# Altium schematic sheet Temp_V_DC_Measurement.SchDoc
size A4; CompanyName: Technische Hochschule Nürnberg Georg Simon Ohm; Organization: UltraZohm; Address1: Kesslerplatz 12; Address2: 90489 Nürnberg; Address3: GERMANY; SheetNumber: 5; SheetTotal: 7; Website: www.ultrazohm.com
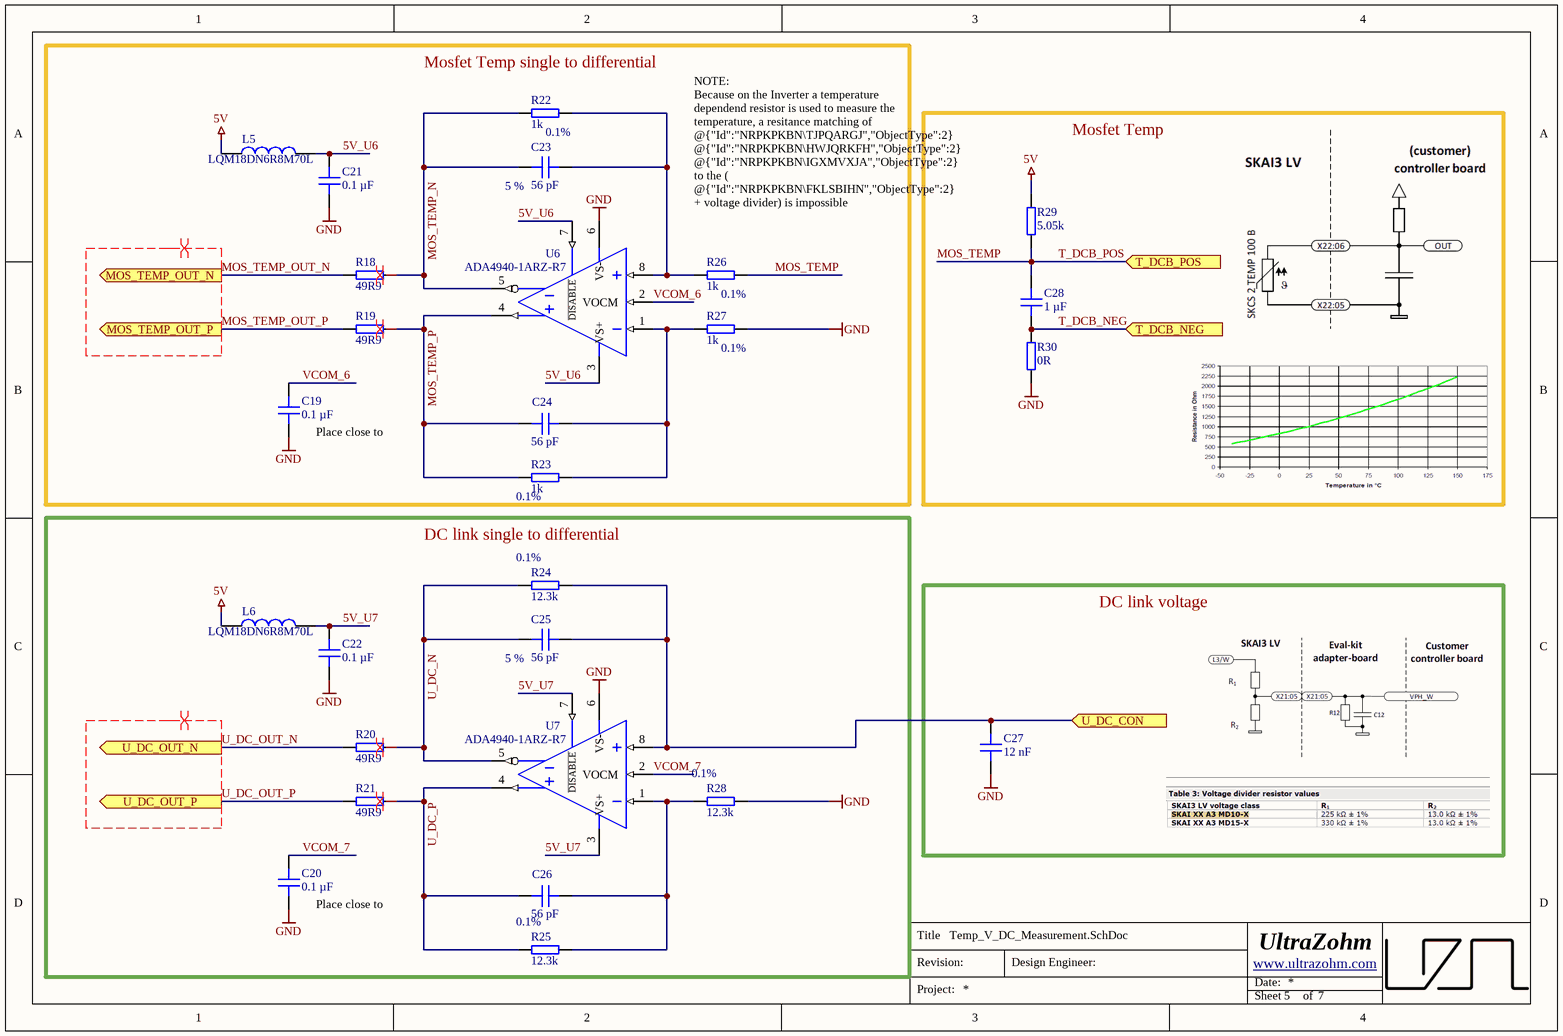
[diagram p0: Temp_V_DC_Measurement.SchDoc]

## Parts
C19  0.1 µF  [C_0603]
C20  0.1 µF  [C_0603]
C21  0.1 µF  [C_0603]
C22  0.1 µF  [C_0603]
C23  56 pF  Tolerance: 5 %  [C_0603]
C24  56 pF  [C_0603]
C25  56 pF  Tolerance: 5 %  [C_0603]
C26  56 pF  [C_0603]
C27  12 nF  [C_0603]
C28  1 µF  [C_1206]
L5  LQM18DN6R8M70L  [INDC1608X95N]
L6  LQM18DN6R8M70L  [INDC1608X95N]
R18  49R9  [RES 0603_1608]
R19  49R9  [RES 0603_1608]
R20  49R9  [RES 0603_1608]
R21  49R9  [RES 0603_1608]
R22  1k  Tolerance: 0.1%  [RES 0603_1608]
R23  1k  Tolerance: 0.1%  [RES 0603_1608]
R24  12.3k  Tolerance: 0.1%  [RES 0603_1608]
R25  12.3k  Tolerance: 0.1%  [RES 0603_1608]
R26  1k  Tolerance: 0.1%  [RES 0603_1608]
R27  1k  Tolerance: 0.1%  [RES 0603_1608]
R28  12.3k  Tolerance: 0.1%  [RES 0603_1608]
R29  5.05k  [RES 0603_1608]
R30  0R  [RES 0603_1608]
U6  ADA4940-1ARZ-R7  [SOT127P600X175-8N]
U7  ADA4940-1ARZ-R7  [SOT127P600X175-8N]

## Blocks framed on the sheet
Mosfet Temp single to differential: C19 C21 C23 C24 L5 R18 R19 R22 R23 R26 R27 U6
Mosfet Temp: C28 R29 R30
DC link single to differential: C20 C22 C25 C26 L6 R20 R21 R24 R25 R28 U7
DC link voltage: C27

## Ports
MOS_TEMP_OUT_N (out), MOS_TEMP_OUT_P (out), T_DCB_NEG (in), T_DCB_POS (in), U_DC_CON (in), U_DC_OUT_N (out), U_DC_OUT_P (out)

## Nets
5V: L5.1 L6.1 R29.2
GND: C19.1 C20.1 C21.1 C22.1 C27.1 R27.1 R28.2 R30.1 U6.6(VS-) U7.6(VS-)
5V_U6: C21.2 L5.2 U6.3(VS+) U6.7(~{DISABLE})
5V_U7: C22.2 L6.2 U7.3(VS+) U7.7(~{DISABLE})
MOS_TEMP: C28.2 R26.1 R29.1 ; port T_DCB_POS  [also labelled T_DCB_POS]
MOS_TEMP_N: C23.1 R18.2 R22.2 U6.5(VOUT-)
MOS_TEMP_OUT_N: R18.1 ; port MOS_TEMP_OUT_N
MOS_TEMP_OUT_P: R19.1 ; port MOS_TEMP_OUT_P
MOS_TEMP_P: C24.1 R19.2 R23.2 U6.4(VOUT+)
T_DCB_NEG: C28.1 R30.2 ; port T_DCB_NEG
U_DC_CON: C25.2 C27.2 R24.2 U7.8(VIN+) ; port U_DC_CON
U_DC_N: C25.1 R20.2 R24.1 U7.5(VOUT-)
U_DC_OUT_N: R20.1 ; port U_DC_OUT_N
U_DC_OUT_P: R21.1 ; port U_DC_OUT_P
U_DC_P: C26.1 R21.2 R25.1 U7.4(VOUT+)
VCOM_6: C19.2 U6.2(VOCM)
VCOM_7: C20.2 U7.2(VOCM)
NetC23_2: C23.2 R22.1 R26.2 U6.8(VIN+)
NetC24_2: C24.2 R23.1 R27.2 U6.1(VIN-)
NetC26_2: C26.2 R25.2 R28.1 U7.1(VIN-)

## Layout directives
differential pair: MOS_TEMP_N, MOS_TEMP_OUT_N, MOS_TEMP_OUT_P, MOS_TEMP_P, U_DC_N, U_DC_OUT_N, U_DC_OUT_P, U_DC_P

## Notes on the sheet
- (near R26) NOTE:
  Because on the Inverter a temperature dependend resistor is used to measure the temperature, a resitance matching of @{"Id":"NRPKPKBN\TJPQARGJ","ObjectType":2} @{"Id":"NRPKPKBN\HWJQRKFH","ObjectType":2} @{"Id":"NRPKPKBN\IGXMVXJA","ObjectType":2} to the ( @{"Id":"NRPKPKBN\FKLSBIHN","ObjectType":2} + voltage divider) is impossible
- (near C19) Place close to @{"Id":"NRPKPKBN\YIMAHXXS","ObjectType":2}
- (near C20) Place close to @{"Id":"NRPKPKBN\RQVLHYIW","ObjectType":2}
- Title
- Revision:
- Design Engineer:
- Date:
- Project:
- Sheet
- of

## Library data of the parts
C19-C22 = C0603X104K5RAC7411: Capacitor 0603, 50 VDC, 0.1 µF, X7R; Manufacturer: KEMET; Tolerance: 10 %; Voltage Rating: 50 VDC; Created from: MGremer; Manufacturer Part Number: C0603X104K5RAC7411; PartID: 3; Created On: 20.12.2020 13:54:13; ComponentLink1Description: Datasheet; ComponentLink1URL: https://www.mouser.de/datasheet/2/212/1/KEM_C1013_X7R_FT_CAP_SMD-1103280.pdf; Component Type: Capacitor 0603; Device Package: 0603; Last Updated: 04.03.2021 09:24:28; Mounting Type: SMD; Operating Temperature: -55 - 125°C; Series: SMD Comm X7R Flex; Supplier 1: Mouser; Supplier Part Number 1: 80-C0603X104K5R7411; Supplier 2: LCSC; Supplier Part Number 2: C14663; Type: Capacitor; Value: 0.1 µF; Live Cycle Status: 1; LCSC Part Number: C14663; Stock number: Labor SMD Container
C23 C25 = CL10C560JB8NNNC: Capacitor 0603, 50 VDC, 56 pF, C0G; Manufacturer: Samsung Electro-Mechanics; Voltage Rating: 50 VDC; Created from: DHufnagel; Manufacturer Part Number: CL10C560JB8NNNC; PartID: 92; Created On: 20.12.2020 13:54:13; ComponentLink1Description: Datasheet; ComponentLink1URL: https://www.mouser.de/datasheet/2/585/MLCC-1837944.pdf; Component Type: Capacitor 0603; Device Package: 0603; Last Updated: 20.12.2020 16:24:16; Mounting Type: SMD; Operating Temperature: -55 - 125°C; Series: CL; Supplier 1: Mouser; Supplier Part Number 1: 187-CL10C560JB8NNNC; Type: Capacitor; Value: 56 pF; Live Cycle Status: 1; Stock number: not stored; Supplier 2: LCSC; Supplier Part Number 2: C39148; LCSC Part Number: C39148
C24 C26 = CL10C560JB8NNNC: Capacitor 0603, 50 VDC, 56 pF, C0G; Manufacturer: Samsung Electro-Mechanics; Tolerance: 5 %; Voltage Rating: 50 VDC; Created from: DHufnagel; Manufacturer Part Number: CL10C560JB8NNNC; PartID: 92; Created On: 20.12.2020 13:54:13; ComponentLink1Description: Datasheet; ComponentLink1URL: https://www.mouser.de/datasheet/2/585/MLCC-1837944.pdf; Component Type: Capacitor 0603; Device Package: 0603; Last Updated: 20.12.2020 16:24:16; Mounting Type: SMD; Operating Temperature: -55 - 125°C; Series: CL; Supplier 1: Mouser; Supplier Part Number 1: 187-CL10C560JB8NNNC; Supplier 2: LCSC; Supplier Part Number 2: C39148; Type: Capacitor; Value: 56 pF; Live Cycle Status: 1; LCSC Part Number: C39148; Stock number: not stored
C27 = CC0603KRX7R7BB123: Capacitor 0603, 16 VDC, 12 nF, X7R; Manufacturer: Yageo; Tolerance: 10 %; Voltage Rating: 16 VDC; Created from: MGremer; Manufacturer Part Number: CC0603KRX7R7BB123; PartID: 47; Created On: 20.12.2020 13:54:13; ComponentLink1Description: Datasheet; ComponentLink1URL: https://www.mouser.de/datasheet/2/447/UPY-GPHC_X7R_6.3V-to-50V_18-1154002.pdf; Component Type: Capacitor 0603; Device Package: 0603; Last Updated: 16.04.2024 13:21:40; Mounting Type: SMD; Operating Temperature: -55 - 125°C; Series: CC; Supplier 1: Mouser; Supplier Part Number 1: 603-CC603KRX7R7BB123; Type: Capacitor; Value: 12 nF; Live Cycle Status: 1; LCSC Part Number: C519427; Stock number: not stored
C28 = C1206X105K5RECAUTO: Capacitor 1206, 50 VDC, 1 µF, X7R; Manufacturer: KEMET; Tolerance: 10 %; Voltage Rating: 50 VDC; Created from: MGremer; Manufacturer Part Number: C1206X105K5RECAUTO; PartID: 39; Created On: 20.12.2020 13:54:13; ComponentLink1Description: Datasheet; ComponentLink1URL: https://www.mouser.de/datasheet/2/212/1/KEM_C1090_X7R_ESD-1103328.pdf; Component Type: Capacitor 1206; Device Package: 1206; Last Updated: 24.10.2023 13:41:37; Mounting Type: SMD; Operating Temperature: -55 - 125°C; Series: ESD SMD Auto X7R; Supplier 1: Mouser; Supplier Part Number 1: 80-C1206X105K5REAUTO; Type: Capacitor; Value: 1 µF; Live Cycle Status: 1; LCSC Part Number: C107185; Stock number: Labor SMD Container
L5 L6 = LQM18DN6R8M70L: 6.8µH, 120mA, 0603, 740mOhm, 20%; Manufacturer: Murata; MF: EPCOS / TDK; Value: 6.8uH; DCR: 320m; Rated Current: 0.85 A; Type: fixed inductor; Created from: DHufnagel; MPN: B82464G4154M; Supplier 1: Mouser; Supplier Part Number 1: 81-LQM18DN6R8M70L; Manufacturer Part Number: LQM18DN6R8M70L; PartID: 10; Created On: 19.07.2022 15:47:17; ComponentLink1Description: Datasheet; ComponentLink1URL: https://www.mouser.de/datasheet/2/281/1/JELF243B_0086-2298241.pdf; Component Type: SMD fixed inductor; Device Package: SMD; Last Updated: 15.06.2023 16:03:16; Mounting Type: SMD; Operating Temperature: -40 - 125°C; Series: LQM18DN_70; Supplier 2: Digi-Key; Supplier Part Number 2: 490-LQM18DN6R8M70LCT-ND; DC current: 120mA; Live Cycle Status: 1; Stock number: not stored; LCSC Part Number: C1881372
R18-R21 = RK73H1JTTD49R9F: SMD resistor 1%; Manufacturer: KOA Speer; Created from: DHufnagel; Manufacturer Part Number: RK73H1JTTD49R9F; PartID: 214; Created On: 14.12.2020 16:17:14; ComponentLink1Description: Datasheet; ComponentLink1URL: https://www.mouser.de/datasheet/2/219/RK73H-1825326.pdf; Component Type: SMD resistor; Device Package: 0603; Last Updated: 27.05.2022 13:46:35; Mounting Type: SMD; Supplier 1: Mouser; Supplier Part Number 1: 660-RK73H1JTTD49R9F; Supplier 2: LCSC; Supplier Part Number 2: C160046; Type: Resistor; Tolerance: 1%; Value: 49R9; Live Cycle Status: 1; Stock number: not stored; LCSC Part Number: C160046
R22 R23 R26 R27 = PCF-W0603LF-03-1001-B-P-LT: SMD resistor 0.1%; Manufacturer: IRC / TT Electronics; Created from: MGremer; Manufacturer Part Number: PCF-W0603LF-03-1001-B-P-LT; PartID: 163; Created On: 14.12.2020 16:17:14; ComponentLink1Description: Datasheet; ComponentLink1URL: https://www.mouser.de/datasheet/2/414/PCF-1528243.pdf; Component Type: SMD resistor; Device Package: 0603; Last Updated: 21.02.2024 15:45:55; Mounting Type: SMD; Supplier 1: Mouser; Supplier Part Number 1: 66-PCFW0603LF031001B; Type: Resistor; Value: 1k; Live Cycle Status: 1; Stock number: not stored; LCSC Part Number: C110776
R24 R25 R28 = RT0603BRD0712K3L: SMD resistor E24 series 12 kOhms 100mW 0603 1%; Manufacturer: YAGEO; Created from: DHufnagel; Manufacturer Part Number: RT0603BRD0712K3L; PartID: 333; Created On: 10.02.2023 10:27:45; ComponentLink1Description: Datasheet; ComponentLink1URL: https://www.mouser.de/datasheet/2/447/PYu_RT_1_to_0_01_RoHS_L_12-3003070.pdf; Component Type: SMD resistor; Device Package: 0603; Last Updated: 03.05.2024 10:37:15; Mounting Type: SMD; Supplier 1: Mouser; Supplier Part Number 1: 603-RT0603BRD0712K3L; Type: Resistor; Value: 12.3k; Live Cycle Status: 1; Stock number: not stored; LCSC Part Number: C861101
R29 = TNPW06035K05BEEA: SMD resistor 0.1%; Manufacturer: Vishay; Created from: DHufnagel; Manufacturer Part Number: TNPW06035K05BEEA; PartID: 338; Created On: 01.12.2022 09:50:56; ComponentLink1Description: Datasheet; ComponentLink1URL: https://www.vishay.com/doc?28758; Component Type: SMD resistor; Device Package: 0603; Last Updated: 03.05.2024 10:51:07; Mounting Type: SMD; Supplier 1: Mouser; Supplier Part Number 1: 71-TNPW06035K05BEEA; Type: Resistor; Tolerance: 0.1%; Value: 5.05k; Live Cycle Status: 1; Stock number: not stored; LCSC Part Number: C1693738
R30 = RC0603JR-070RL: SMD resistor E24 series; Manufacturer: YAGEO; Tolerance: 5%; Created from: MGremer; Manufacturer Part Number: RC0603JR-070RL; PartID: 1; Created On: 14.12.2020 16:17:14; ComponentLink1Description: Datasheet; ComponentLink1URL: https://www.mouser.de/datasheet/2/447/PYu-RC_Group_51_RoHS_L_10-1664068.pdf; Component Type: SMD resistor; Device Package: 0603; Last Updated: 04.03.2021 09:09:42; Mounting Type: SMD; Supplier 1: Mouser; Supplier Part Number 1: 603-RC0603JR-070RL; Supplier 2: LCSC; Supplier Part Number 2: C21189; Type: Resistor; Value: 0R; Live Cycle Status: 1; Stock number: Labor SMD Container; LCSC Part Number: C21189
U6 U7 = ADA4940-1ARZ-R7: Fully Differential Amplifier, Ultralow-Power,Low Distortion, 260-MHz; Manufacturer: Analog Devices; Channels: 1; GBP: 260 MHz; CMRR: 86 dB; Created from: DHufnagel; Manufacturer Part Number: ADA4940-1ARZ-R7; PartID: 14; Created On: 18.08.2022 12:53:27; ComponentLink1Description: Datasheet; ComponentLink1URL: https://www.mouser.de/datasheet/2/609/ada4940_1_4940_2-2955874.pdf; Component Type: Differential Amplifier; Device Package: SOIC-8; Last Updated: 18.08.2022 13:04:18; Mounting Type: SMD; Operating Temperature: -40 - 105°C; Series: ADA4940-1; Supplier 1: Mouser; Supplier Part Number 1: 584-ADA4940-1ARZ; Supplier 2: Digi-Key; Supplier Part Number 2: 505-ADA4940-1ARZ-ND; Supplier 3: LCSC; Supplier Part Number 3: C730049; Type: Differential Amplifiers; Live Cycle Status: 1; LCSC Part Number: C730049; Stock number: not stored